# EAGLE design HighVBoard_01 (EAGLE 9.2.2)
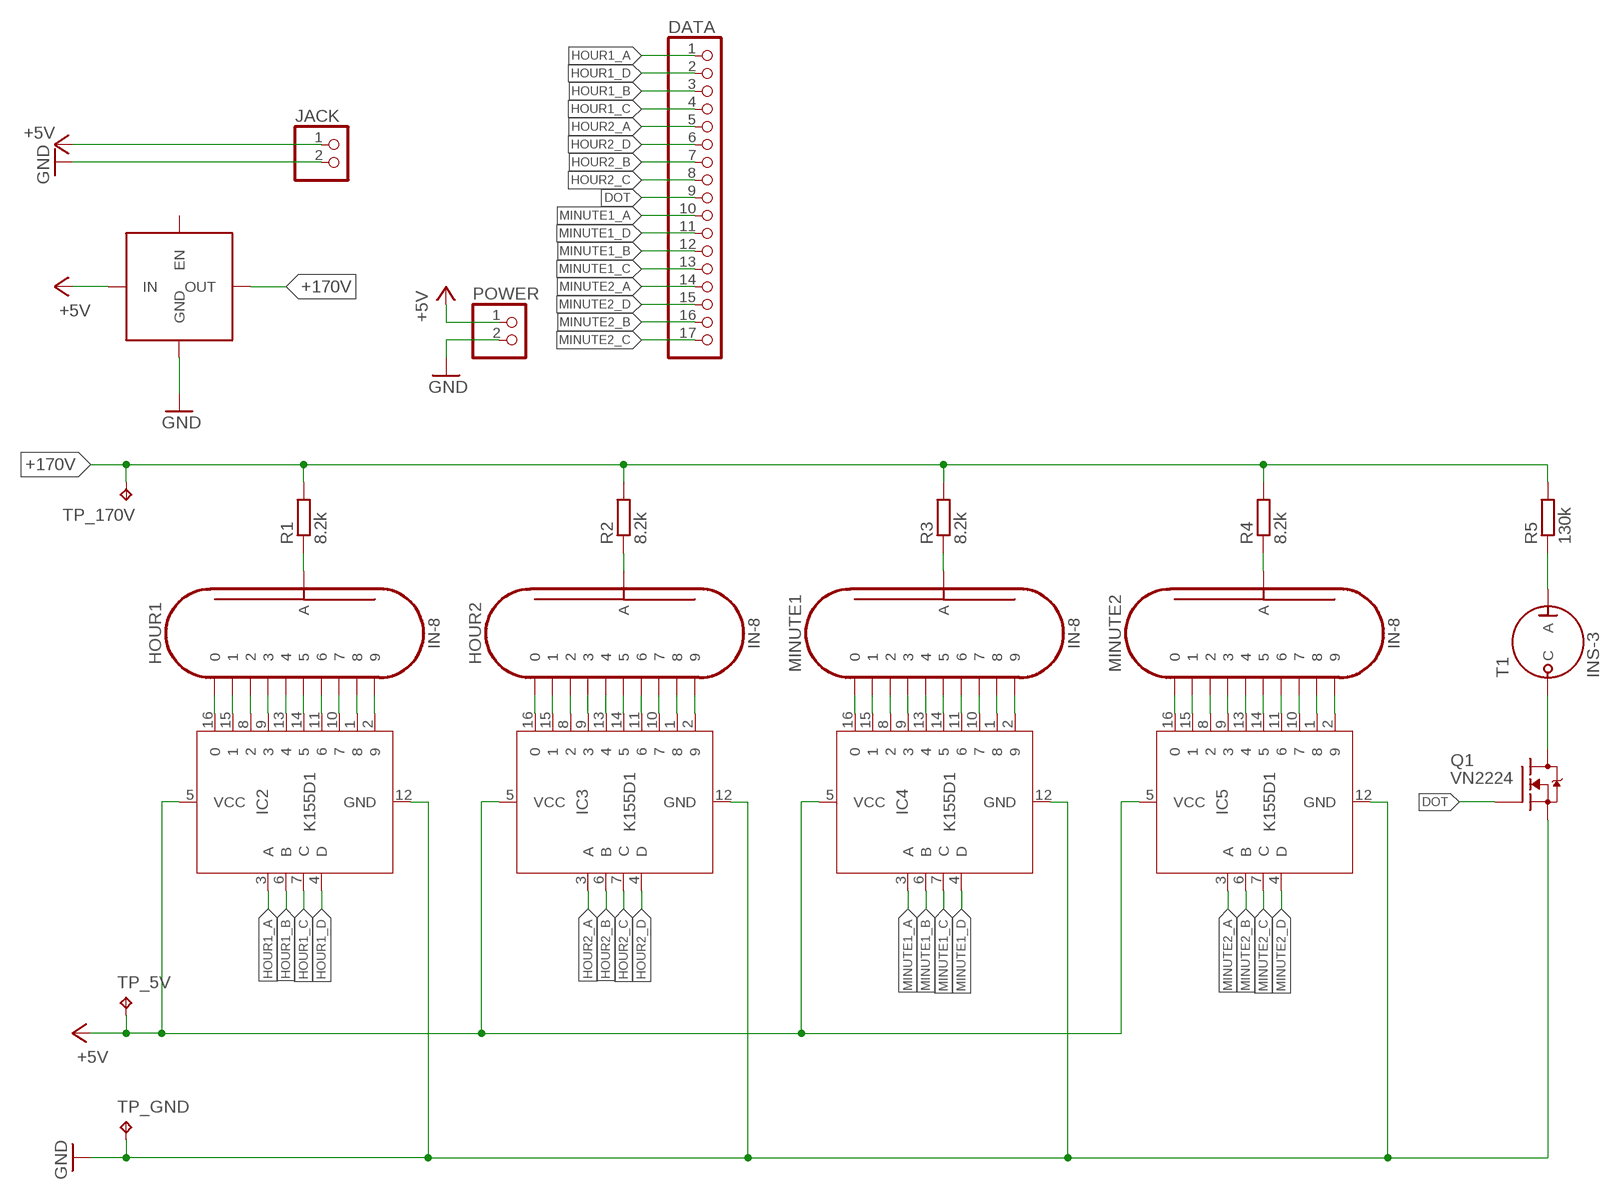
[diagram p0: schematic, sheet 1]

## Parts
DATA  PINHD-1X17  [1X17]
HOUR1  IN-8  [IN-8]
HOUR2  IN-8  [IN-8]
IC2  K155D1  [DIL16]
IC3  K155D1  [DIL16]
IC4  K155D1  [DIL16]
IC5  K155D1  [DIL16]
JACK  PINHD-1X2/90  [1X02/90]
MINUTE1  IN-8  [IN-8]
MINUTE2  IN-8  [IN-8]
POWER  PINHD-1X2  [1X02]
Q1  VN2224  [TO92]
R1  8.2k  R-EU_0207/10  [0207/10]
R2  8.2k  R-EU_0207/10  [0207/10]
R3  8.2k  R-EU_0207/10  [0207/10]
R4  8.2k  R-EU_0207/10  [0207/10]
R5  130k  R-EU_0207/10  [0207/10]
T1  INS-3  [INS-3]
TP_5V  TPPAD1-13  [P1-13]
TP_170V  TPPAD1-13  [P1-13]
TP_GND  TPPAD1-13  [P1-13]
U$1  NIXIE-PSU  [NIXIE-PSU]

## Nets
+5V [+5V]: IC2.5(VCC) IC3.5(VCC) IC4.5(VCC) IC5.5(VCC) JACK.1 POWER.1 TP_5V.TP U$1.1(IN)
+170V [+170V]: R1.2 R2.2 R3.2 R4.2 R5.2 TP_170V.TP U$1.5(OUT)
DOT: DATA.9 Q1.2(G)
GND [GND]: IC2.12(GND) IC3.12(GND) IC4.12(GND) IC5.12(GND) JACK.2 POWER.2 Q1.1(S) TP_GND.TP U$1.2(GND) U$1.4(GND)
HOUR1_A: DATA.1 IC2.3(A)
HOUR1_B: DATA.3 IC2.6(B)
HOUR1_C: DATA.4 IC2.7(C)
HOUR1_D: DATA.2 IC2.4(D)
HOUR2_A: DATA.5 IC3.3(A)
HOUR2_B: DATA.7 IC3.6(B)
HOUR2_C: DATA.8 IC3.7(C)
HOUR2_D: DATA.6 IC3.4(D)
MINUTE1_A: DATA.10 IC4.3(A)
MINUTE1_B: DATA.12 IC4.6(B)
MINUTE1_C: DATA.13 IC4.7(C)
MINUTE1_D: DATA.11 IC4.4(D)
MINUTE2_A: DATA.14 IC5.3(A)
MINUTE2_B: DATA.16 IC5.6(B)
MINUTE2_C: DATA.17 IC5.7(C)
MINUTE2_D: DATA.15 IC5.4(D)
N$1: Q1.3(D) T1.C
N$7: HOUR1.10 IC2.16
N$10 [+170V]: HOUR1.1 IC2.15
N$11 [+170V]: HOUR1.2 IC2.8
N$12 [+170V]: HOUR1.3 IC2.9
N$13 [+170V]: HOUR1.4 IC2.13
N$14 [+170V]: HOUR1.5 IC2.14
N$15 [+170V]: HOUR1.6 IC2.11
N$16 [+170V]: HOUR1.7 IC2.10
N$17 [+170V]: HOUR1.8 IC2.1
N$18 [+170V]: HOUR1.9 IC2.2
N$19 [+170V]: HOUR1.A R1.1
N$20 [+170V]: HOUR2.10 IC3.16
N$21 [+170V]: HOUR2.1 IC3.15
N$22 [+170V]: HOUR2.2 IC3.8
N$23 [+170V]: HOUR2.3 IC3.9
N$24 [+170V]: HOUR2.4 IC3.13
N$25 [+170V]: HOUR2.5 IC3.14
N$26 [+170V]: HOUR2.6 IC3.11
N$27 [+170V]: HOUR2.7 IC3.10
N$28 [+170V]: HOUR2.8 IC3.1
N$29 [+170V]: HOUR2.9 IC3.2
N$30 [+170V]: HOUR2.A R2.1
N$31 [+170V]: IC4.16 MINUTE1.10
N$32 [+170V]: IC4.15 MINUTE1.1
N$33 [+170V]: IC4.8 MINUTE1.2
N$34 [+170V]: IC4.9 MINUTE1.3
N$35 [+170V]: IC4.13 MINUTE1.4
N$36 [+170V]: IC4.14 MINUTE1.5
N$37 [+170V]: IC4.11 MINUTE1.6
N$38 [+170V]: IC4.10 MINUTE1.7
N$39 [+170V]: IC4.1 MINUTE1.8
N$40 [+170V]: IC4.2 MINUTE1.9
N$41 [+170V]: MINUTE1.A R3.1
N$42 [+170V]: IC5.16 MINUTE2.10
N$43 [+170V]: IC5.15 MINUTE2.1
N$44 [+170V]: IC5.8 MINUTE2.2
N$45 [+170V]: IC5.9 MINUTE2.3
N$46 [+170V]: IC5.13 MINUTE2.4
N$47 [+170V]: IC5.14 MINUTE2.5
N$48 [+170V]: IC5.11 MINUTE2.6
N$49 [+170V]: IC5.10 MINUTE2.7
N$50 [+170V]: IC5.1 MINUTE2.8
N$51 [+170V]: IC5.2 MINUTE2.9
N$52 [+170V]: MINUTE2.A R4.1
N$55 [+170V]: R5.1 T1.A
Unconnected: U$1.3(EN)

## Library data of the parts
DATA = pinhead:PINHD-1X17: PIN HEADER
HOUR1 HOUR2 MINUTE1 MINUTE2 = Nixie:IN-8
IC2-IC5 = Nixie:K155D1
JACK POWER = pinhead:PINHD-1X2: PIN HEADER
Q1 = Nixie:VN2224
R1-R5 = resistor:R-EU_: RESISTOR, European symbol
T1 = Nixie:INS-3
TP_5V TP_170V TP_GND = testpad:TP: Test pad
U$1 = Nixie:NIXIE-PSU

## Net classes
0 SIGNAL: width 0.203 mm, clearance 0.203 mm
2 +5V: width 0.406 mm, clearance 0.203 mm
3 +170V: width 0.203 mm, clearance 0.406 mm
4 GND: clearance 0.203 mm

## Board
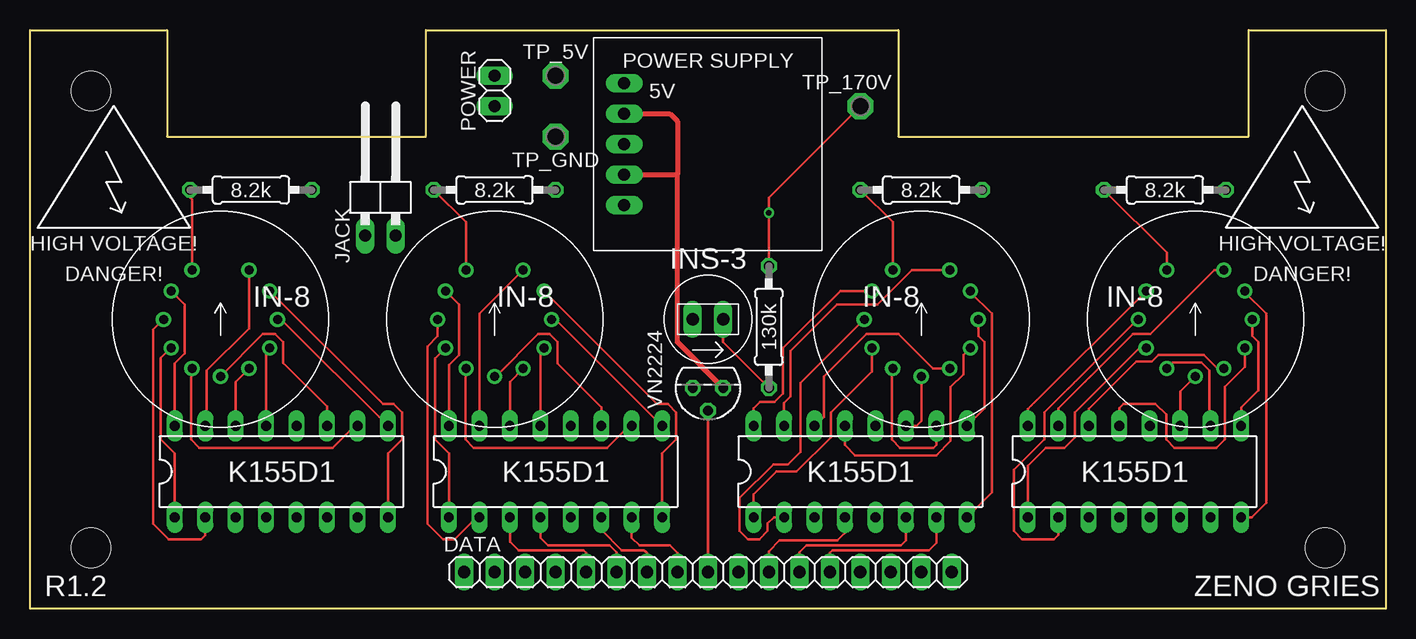
[diagram p1: board, top side]
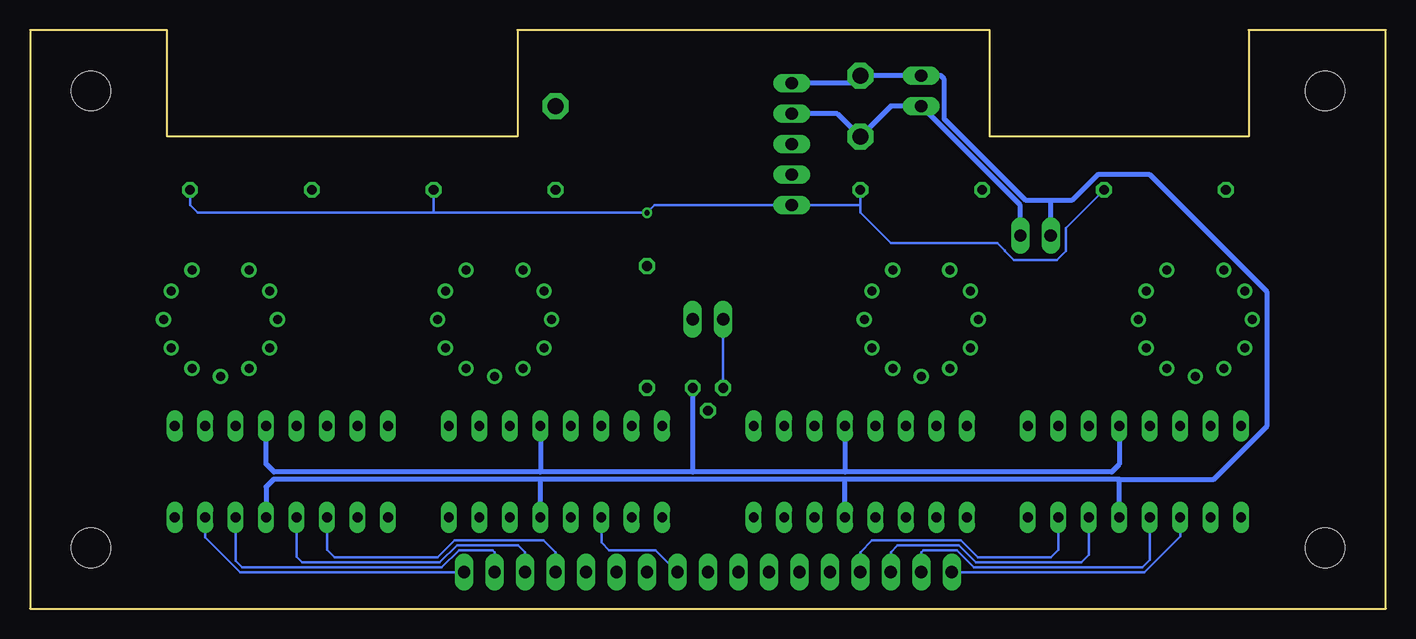
[diagram p2: board, bottom side, seen from below]

Size 113.03 x 48.26 mm. Coordinates in mm from the lower left corner, seen from the top.
Outline: 0,0 0,48.26 11.43,48.26 11.43,39.37 33.02,39.37 33.02,48.26 72.39,48.26 72.39,39.37 101.6,39.37 101.6,48.26 113.03,48.26 113.03,0 0,0
Copper layers (1*16): Top 0.035mm / dielectric 1.5mm / Bottom 0.035mm
Design rules "default": minimum track width 6mil, minimum drill 0.35mm, track to track 6mil, track to pad 6mil, pad to pad 6mil, via to via 6mil, smd to smd 6mil, copper to edge 40mil, drill to drill 6mil, minimum pad ring 10mil, minimum via ring 8mil, stop-mask expansion 4mil, vias tented up to drill 0mil, thermal gap 10mil
Holes 3.3 mm at 5.08,5.08 107.95,5.08 107.95,43.18 5.08,43.18

### Footprints (pad centres in the part's own frame; a part is rotated, then mirrored left to right if it is on the bottom)
1X17 = drill 1.016 long: 1 -20.32,0; 2 -17.78,0; 3 -15.24,0; 4 -12.7,0; 5 -10.16,0; 6 -7.62,0; 7 -5.08,0; 8 -2.54,0; 9 0,0; 10 2.54,0; 11 5.08,0; 12 7.62,0; 13 10.16,0; 14 12.7,0; 15 15.24,0; 16 17.78,0; 17 20.32,0
IN-8 = drill 0.75: 1 2.375,4.11; 2 4.11,2.375; 3 4.75,0; 4 4.11,-2.375; 5 2.375,-4.11; 6 0,-4.75; 7 -2.375,-4.11; 8 -4.11,-2.375; 9 -4.75,0; 10 -4.11,2.375; A -2.375,4.11
DIL16 = drill 0.813 long: 1 -8.89,-3.81; 2 -6.35,-3.81; 3 -3.81,-3.81; 4 -1.27,-3.81; 5 1.27,-3.81; 6 3.81,-3.81; 7 6.35,-3.81; 8 8.89,-3.81; 9 8.89,3.81; 10 6.35,3.81; 11 3.81,3.81; 12 1.27,3.81; 13 -1.27,3.81; 14 -3.81,3.81; 15 -6.35,3.81; 16 -8.89,3.81
1X02/90 = drill 1.016 long: 1 -1.27,-3.81; 2 1.27,-3.81
1X02 = drill 1.016 long: 1 -1.27,0; 2 1.27,0
TO92 = drill 0.813 octagon: 1 -1.27,0; 2 0,1.905; 3 1.27,0
0207/10 = drill 0.813 octagon: 1 -5.08,0; 2 5.08,0
INS-3 = drill 1.016 long: A 1.27,0; C -1.27,0
P1-13 = drill 1.321 pad 2.159 octagon: TP 0,0
NIXIE-PSU = drill 1.016 long: 1 -5.08,0; 2 -2.54,0; 3 0,0; 4 2.54,0; 5 5.08,0

### Placement (x,y rotation side)
DATA  56.52,3.05 0 top
HOUR1  15.88,24.13 0 top
HOUR2  38.73,24.13 0 top
IC2  20.95,11.43 0 top
IC3  43.81,11.43 0 top
IC4  69.22,11.43 0 top
IC5  92.08,11.43 0 top
JACK  29.21,34.92 0 top
MINUTE1  74.3,24.13 0 top
MINUTE2  97.16,24.13 0 top
POWER  38.73,43.18 270 top
Q1  56.52,18.41 180 top
R1  18.41,34.92 0 top
R2  38.73,34.92 0 top
R3  74.3,34.92 0 top
R4  94.61,34.92 0 top
R5  61.59,23.5 90 top
T1  56.52,24.13 0 top
TP_5V  43.81,44.45 0 top
TP_170V  69.22,41.91 0 top
TP_GND  43.81,39.37 0 top
U$1  49.53,38.73 270 top

### Tracks (layer width: path | path; a pad name or v marks a point on that pad's centre or on a via)
+5V
  Bottom 0.406: IC2.5 22.23,10.79 | 22.23,10.79 45.09,10.79 | 45.09,10.79 70.48,10.79 | IC4.5 70.48,10.79 | IC3.5 45.09,10.79 | 22.23,10.79 14.34,10.79 9.89,15.25 9.89,26.4 19.68,36.2 24.02,36.2 26.18,34.04 27.94,34.04 | 27.94,34.04 30,34.04 36.8,40.84 36.8,44.15 37.11,44.45 POWER.1 TP_5V.TP 44.45,43.81 U$1.1 | JACK.1 27.94,34.04 | 70.48,10.79 92.71,10.79 93.34,10.16 IC5.5
+170V  (via drill 0.45)
  Top 0.203: R5.2 v61.59,33.02 61.59,34.29 TP_170V.TP
  Bottom 0.203: 43.81,33.66 U$1.5 60.96,33.66 v61.59,33.02 79.38,33.02 | R2.2 43.81,33.66 | 43.81,33.66 43.81,33.02 41.27,30.48 32.38,30.48 31.75,29.84 31.75,29.83 31.01,29.08 27.41,29.08 26.67,29.83 26.67,31.75 R1.2 | 79.38,33.02 99.06,33.02 99.69,33.66 R4.2 | R3.2 79.38,33.02
DOT
  Top 0.203: DATA.9 Q1.2
GND
  Top 0.406: U$1.4 53.98,36.2 | Q1.1 53.98,22.23 53.98,36.2 | 53.98,36.2 53.98,40.64 53.34,41.27 U$1.2
  Bottom 0.406: U$1.2 45.72,41.27 TP_GND.TP 41.27,41.91 POWER.2 30.48,33.66 JACK.2 | IC2.12 22.23,12.04 22.86,11.4 45.09,11.4 | 45.09,11.4 57.78,11.4 | 57.78,11.4 70.48,11.4 | 70.48,11.4 92.69,11.4 93.34,12.06 IC5.12 | IC3.12 45.09,11.4 | IC4.12 70.48,11.4 | Q1.1 57.78,11.4
HOUR1_A
  Bottom 0.203: DATA.1 20.14,3.05 17.14,6.04 IC2.3
HOUR1_B
  Bottom 0.203: DATA.3 41.27,4.71 40.7,5.28 35.59,5.28 34.16,3.86 25.4,3.86 24.77,4.5 IC2.6
HOUR1_C
  Bottom 0.203: DATA.4 43.81,4.7 42.82,5.69 35.42,5.69 33.99,4.27 27.94,4.27 27.3,4.9 IC2.7
HOUR1_D
  Bottom 0.203: DATA.2 38.73,4.68 38.54,4.88 35.75,4.88 34.33,3.45 20.31,3.45 19.69,4.07 19.69,7.61 IC2.4
HOUR2_A
  Top 0.203: DATA.5 46.35,4.67 46.15,4.88 40.72,4.88 40.01,5.59 IC3.3
HOUR2_B
  Top 0.203: DATA.7 51.44,4.65 51.21,4.88 49.3,4.88 47.62,6.55 IC3.6
HOUR2_C
  Top 0.203: DATA.8 53.98,4.67 53.37,5.28 50.8,5.28 50.16,5.92 IC3.7
HOUR2_D
  Top 0.203: DATA.6 48.9,4.7 48.31,5.28 43.18,5.28 42.55,5.92 IC3.4
MINUTE1_A
  Bottom 0.203: DATA.10 60.88,4.88 64.77,4.88 65.41,5.51 IC4.3
MINUTE1_B
  Top 0.203: DATA.12 64.14,4.7 64.72,5.28 72.59,5.28 73.03,5.71 IC4.6
MINUTE1_C
  Top 0.203: DATA.13 66.67,4.65 66.9,4.88 74.95,4.88 75.56,5.49 IC4.7
MINUTE1_D
  Top 0.203: DATA.11 61.59,4.8 62.48,5.69 67.31,5.69 67.94,6.33 IC4.4
MINUTE2_A
  Bottom 0.203: DATA.14 69.22,4.7 70.21,5.69 77.61,5.69 79.04,4.27 87.63,4.27 88.27,4.9 IC5.3
MINUTE2_B
  Bottom 0.203: DATA.16 74.3,4.71 74.46,4.88 77.28,4.88 78.7,3.45 95.36,3.45 95.89,3.98 IC5.6
MINUTE2_C
  Bottom 0.203: DATA.17 95.53,3.05 98.42,5.94 IC5.7
MINUTE2_D
  Bottom 0.203: DATA.15 71.75,4.71 72.33,5.28 77.44,5.28 78.87,3.86 90.35,3.86 90.81,4.32 IC5.4
N$1
  Bottom 0.203: T1.C Q1.3
N$7
  Top 0.203: IC2.16 12.06,20.45 12.9,21.28 12.9,25.37 HOUR1.10
N$10
  Top 0.203: IC2.15 14.74,15.37 14.74,19.85 18.25,23.36 HOUR1.1
N$11
  Top 0.203: HOUR1.2 29.42,17.07 30.33,17.07 31.01,16.38 31.01,14.1 29.84,12.93 IC2.8
N$12
  Top 0.203: IC2.9 20.95,24.13 HOUR1.3
N$13
  Top 0.203: IC2.13 19.68,21.45 HOUR1.4
N$14
  Top 0.203: IC2.14 17.14,18.91 HOUR1.5
N$15
  Top 0.203: IC2.11 24.77,16.87 21.12,20.51 21.12,22.23 20.46,22.89 19.39,22.89 HOUR1.6 | HOUR1.6
N$16
  Top 0.203: IC2.10 27.08,15.24 25.25,13.41 14.12,13.41 13.44,14.1 13.44,19.96 HOUR1.7
N$17
  Top 0.203: IC2.1 12.06,12.93 10.9,14.1 10.9,20.89 HOUR1.8
N$18
  Top 0.203: IC2.2 14.61,6.12 14.28,5.79 11.58,5.79 10.29,7.08 10.29,23.29 HOUR1.9
N$19
  Top 0.203: R1.1 13.34,34.29 13.5,34.12 HOUR1.A
N$20
  Top 0.203: IC3.16 34.92,20.32 35.76,21.16 35.76,25.37 HOUR2.10
N$21
  Top 0.203: HOUR2.1 37.47,24.59 37.47,20.52 37.5,20.49 37.5,19.55 37.47,19.52 IC3.15
N$22
  Top 0.203: HOUR2.2 52.28,17.07 53.19,17.07 53.87,16.38 53.87,14.1 52.7,12.93 IC3.8
N$23
  Top 0.203: IC3.9 43.81,24.13 HOUR2.3
N$24
  Top 0.203: IC3.13 42.55,21.45 HOUR2.4
N$25
  Top 0.203: IC3.14 40.01,18.91 HOUR2.5
N$26
  Top 0.203: IC3.11 47.62,16.79 43.98,20.43 43.98,22.23 43.32,22.89 42.37,22.89 38.86,19.38 HOUR2.6
N$27
  Top 0.203: IC3.10 49.94,15.24 48.11,13.41 36.98,13.41 36.3,14.1 36.3,19.96 HOUR2.7
N$28
  Top 0.203: HOUR2.8 33.76,20.88 33.76,14.1 34.92,12.93 IC3.1
N$29
  Top 0.203: HOUR2.9 33.98,22.72 33.15,21.89 33.15,7.08 34.44,5.79 35.41,5.79 37.24,7.62 IC3.2
N$30
  Top 0.203: R2.1 36.36,32.22 HOUR2.A
N$31
  Top 0.203: MINUTE1.10 67.54,26.5 62.77,21.73 62.77,17.94 62.08,17.25 60.86,17.25 60.33,16.71 IC4.16
N$32
  Top 0.203: IC4.15 62.87,17.17 63.38,17.69 63.38,21.47 67.28,25.37 70.66,25.37 73.53,28.24 MINUTE1.1
N$33
  Top 0.203: MINUTE1.2 78.41,26.38 80.18,24.6 80.18,9.7 IC4.8
N$34
  Top 0.203: MINUTE1.3 79.05,22.72 79.54,22.23 79.54,16.68 IC4.9
N$35
  Top 0.203: MINUTE1.4 77.81,21.16 77.81,19.55 76.73,18.48 76.73,13.97 75.57,12.8 68.78,12.8 67.94,13.64 IC4.13
N$36
  Top 0.203: IC4.14 66.17,16 66.17,19.34 69.71,22.89 72.39,22.89 75.26,20.02 MINUTE1.5
N$37
  Top 0.203: IC4.11 73.89,15.24 74.3,15.65 MINUTE1.6
N$38
  Top 0.203: IC4.10 75.56,13.66 75.31,13.41 72.54,13.41 71.86,14.1 71.86,19.96 MINUTE1.7
N$39
  Top 0.203: MINUTE1.8 70.19,19.79 66.78,16.38 66.78,14.3 63.91,11.43 62.23,11.43 60.33,9.53 IC4.1
N$40
  Top 0.203: IC4.2 62,7.62 61.49,7.11 61.49,6.48 60.81,5.79 59.84,5.79 59.16,6.48 59.16,9.22 61.98,12.04 63.2,12.04 64.24,13.08 64.24,18.84 69.53,24.13 MINUTE1.9
N$41
  Top 0.203: R3.1 71.92,32.22 MINUTE1.A
N$42
  Top 0.203: IC5.16 83.19,16.64 MINUTE2.10
N$43
  Top 0.203: MINUTE2.1 98.72,28.24 93.38,22.89 91.94,22.89 85.72,16.68 IC5.15
N$44
  Top 0.203: MINUTE2.2 101.27,26.38 103.04,24.6 103.04,8.81 101.85,7.62 IC5.8
N$45
  Top 0.203: MINUTE2.3 101.91,22.72 102.4,22.23 102.4,18.2 100.97,16.76 IC5.9
N$46
  Top 0.203: IC5.13 90.81,16.74 91.13,17.07 93.83,17.07 94.72,16.18 94.72,14.1 95.4,13.41 98.91,13.41 99.59,14.1 99.59,18.48 101.28,20.16 MINUTE2.4
N$47
  Top 0.203: MINUTE2.5 98.98,20.02 97.85,21.16 94.06,21.16 93.52,20.62 92.22,20.62 88.27,16.66 IC5.14
N$48
  Top 0.203: IC5.11 95.89,18.11 MINUTE2.6
N$49
  Top 0.203: MINUTE2.7 95.29,20.52 97.63,20.52 98.29,19.85 98.29,15.37 IC5.10
N$50
  Top 0.203: IC5.1 83.19,11.89 84.7,13.41 86.21,13.41 87.1,14.3 87.1,16.38 92.47,21.75 MINUTE2.8
N$51
  Top 0.203: IC5.2 85.72,6.17 85.34,5.79 82.7,5.79 82.02,6.48 82.02,11.59 84.56,14.13 84.56,16.38 92.3,24.13 MINUTE2.9
N$52
  Top 0.203: R4.1 94.78,29.68 MINUTE2.A
N$55
  Top 0.203: R5.1 57.78,22.23 T1.A

### Text on the board
tPlace: POWER SUPPLY | 5V
tNames: HIGH VOLTAGE! | HIGH VOLTAGE! | DANGER! | DANGER! | IN-8 | IN-8 | IN-8 | IN-8 | R1.2 | ZENO GRIES